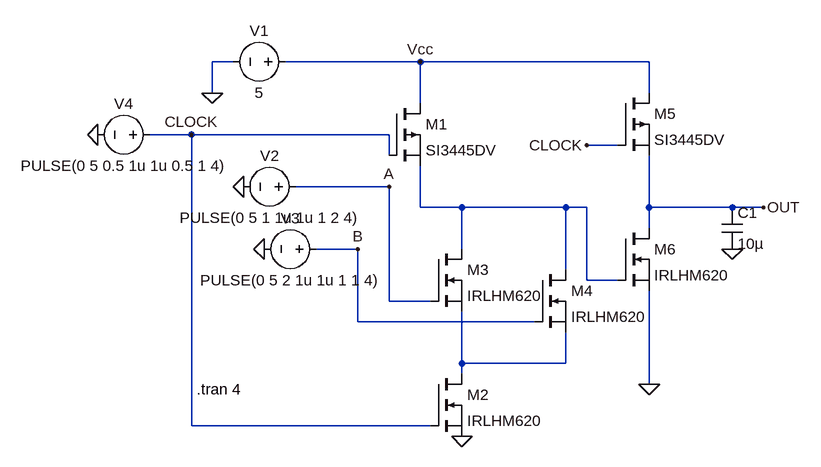
[diagram p0: schematic OR DYN.asc]
OR DYN.asc, the LTspice schematic file:
Version 4.1
SHEET 1 880 680
WIRE -128 -16 -160 -16
WIRE 160 -16 -48 -16
WIRE 512 -16 160 -16
WIRE -160 32 -160 -16
WIRE 512 32 512 -16
WIRE 160 48 160 -16
WIRE -192 96 -256 96
WIRE 112 96 -192 96
WIRE 464 112 416 112
WIRE 112 128 112 96
WIRE 112 176 -32 176
WIRE 160 208 160 144
WIRE 224 208 160 208
WIRE 384 208 224 208
WIRE 416 208 384 208
WIRE 512 208 512 128
WIRE 640 208 512 208
WIRE 688 208 640 208
WIRE 512 240 512 208
WIRE 64 272 0 272
WIRE 224 272 224 208
WIRE 384 304 384 208
WIRE 416 320 416 208
WIRE 464 320 416 320
WIRE 112 352 112 176
WIRE 176 352 112 352
WIRE 64 384 64 272
WIRE 336 384 64 384
WIRE 224 448 224 368
WIRE 384 448 384 400
WIRE 384 448 224 448
WIRE 224 464 224 448
WIRE 512 480 512 336
WIRE -192 544 -192 96
WIRE 176 544 -192 544
FLAG -160 32 0
FLAG 160 -16 Vcc
FLAG -112 176 0
FLAG -80 272 0
FLAG 112 176 A
FLAG 64 272 B
FLAG -336 96 0
FLAG 224 560 0
FLAG -192 96 CLOCK
FLAG 688 208 OUT
FLAG 512 480 0
FLAG 640 272 0
FLAG 416 112 CLOCK
SYMBOL pmos 112 48 R0
SYMATTR InstName M1
SYMATTR Value SI3445DV
SYMBOL voltage -32 -16 R90
WINDOW 0 -32 56 VBottom 2
WINDOW 3 32 56 VTop 2
WINDOW 123 0 0 Left 0
WINDOW 39 0 0 Left 0
SYMATTR InstName V1
SYMATTR Value 5
SYMBOL nmos 176 272 R0
SYMATTR InstName M3
SYMATTR Value IRLHM620
SYMBOL voltage -16 176 R90
WINDOW 0 -32 56 VBottom 2
WINDOW 3 32 56 VTop 2
WINDOW 123 0 0 Left 0
WINDOW 39 0 0 Left 0
SYMATTR InstName V2
SYMATTR Value PULSE(0 5 1 1u 1u 1 2 4)
SYMBOL voltage 16 272 R90
WINDOW 0 -32 56 VBottom 2
WINDOW 3 32 56 VTop 2
WINDOW 123 0 0 Left 0
WINDOW 39 0 0 Left 0
SYMATTR InstName V3
SYMATTR Value PULSE(0 5 2 1u 1u 1 1 4)
SYMBOL voltage -240 96 R90
WINDOW 0 -32 56 VBottom 2
WINDOW 3 32 56 VTop 2
WINDOW 123 0 0 Left 0
WINDOW 39 0 0 Left 0
SYMATTR InstName V4
SYMATTR Value PULSE(0 5 0.5 1u 1u 0.5 1 4)
SYMBOL nmos 176 464 R0
SYMATTR InstName M2
SYMATTR Value IRLHM620
SYMBOL nmos 336 304 R0
SYMATTR InstName M4
SYMATTR Value IRLHM620
SYMBOL pmos 464 32 R0
SYMATTR InstName M5
SYMATTR Value SI3445DV
SYMBOL nmos 464 240 R0
SYMATTR InstName M6
SYMATTR Value IRLHM620
SYMBOL cap 624 208 R0
SYMATTR InstName C1
SYMATTR Value 10µ
TEXT -184 488 Left 2 !.tran 4

The netlist it stands for:
* OR DYN.asc
M1 Vcc CLOCK N001 N001 SI3445DV
V1 Vcc 0 5
M3 N001 A N002 N002 IRLHM620
V2 A 0 PULSE(0 5 1 1u 1u 1 2 4)
V3 B 0 PULSE(0 5 2 1u 1u 1 1 4)
V4 CLOCK 0 PULSE(0 5 0.5 1u 1u 0.5 1 4)
M2 N002 CLOCK 0 0 IRLHM620
M4 N001 B N002 N002 IRLHM620
M5 Vcc CLOCK OUT OUT SI3445DV
M6 OUT N001 0 0 IRLHM620
C1 OUT 0 10µ
.model NMOS NMOS
.model PMOS PMOS
.lib standard.mos
.tran 4
.backanno
.end